# Altium schematic sheet FPGA_POWER.SchDoc
size A4
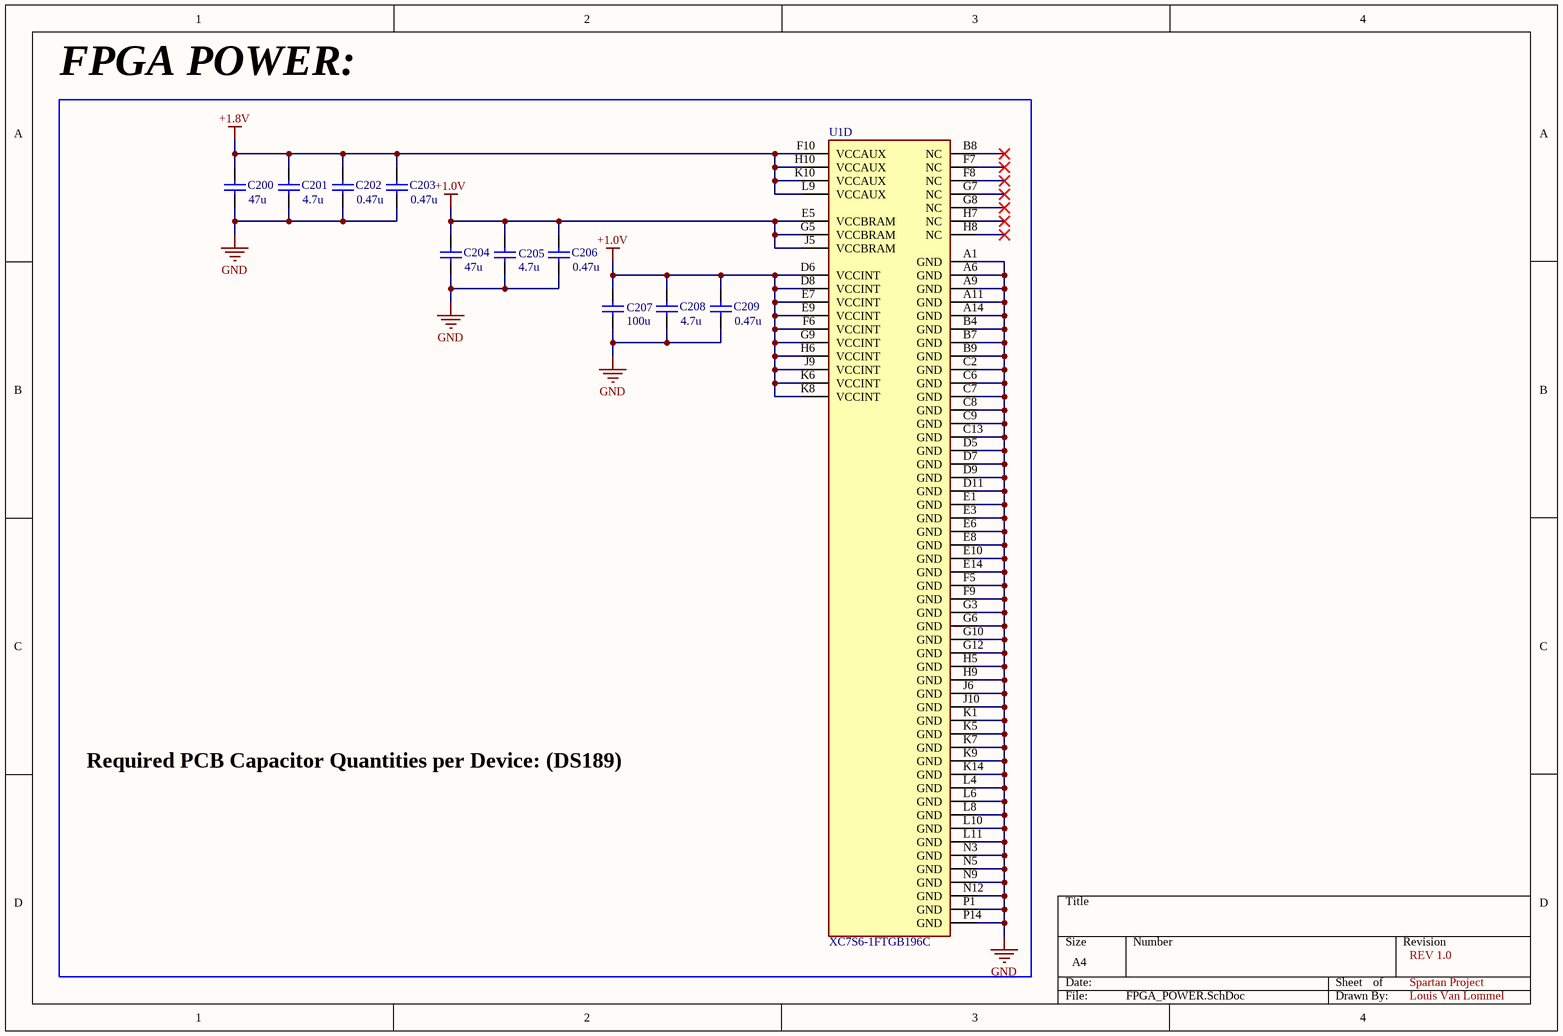
[diagram p0: FPGA_POWER.SchDoc]

## Parts
C200  value 47u  [CAP_0603]  (hidden comment: 47uF)
C201  4.7u  [CAP_0402]
C202  value 0.47u  [CAP_0402]  (hidden comment: 0.47uF)
C203  value 0.47u  [CAP_0402]  (hidden comment: 0.47uF)
C204  value 47u  [CAP_0603]  (hidden comment: 47uF)
C205  4.7u  [CAP_0402]
C206  value 0.47u  [CAP_0402]  (hidden comment: 0.47uF)
C207  value 100u  [CAP_0805]  (hidden comment: 100uF)
C208  4.7u  [CAP_0402]
C209  value 0.47u  [CAP_0402]  (hidden comment: 0.47uF)
U1  XC7S6-1FTGB196C  [FP-XC7S6-1FTGB196C-MFG]  (part D of 4)

## Nets
+1.0V: C204.2 C205.2 C206.2 C207.2 C208.2 C209.2 U1.D6(VCCINT) U1.D8(VCCINT) U1.E5(VCCBRAM) U1.E7(VCCINT) U1.E9(VCCINT) U1.F6(VCCINT) U1.G5(VCCBRAM) U1.G9(VCCINT) U1.H6(VCCINT) U1.J5(VCCBRAM) U1.J9(VCCINT) U1.K6(VCCINT) U1.K8(VCCINT)
+1.8V: C200.2 C201.2 C202.2 C203.2 U1.F10(VCCAUX) U1.H10(VCCAUX) U1.K10(VCCAUX) U1.L9(VCCAUX)
GND: C200.1 C201.1 C202.1 C203.1 C204.1 C205.1 C206.1 C207.1 C208.1 C209.1 U1.A1(GND) U1.A6(GND) U1.A9(GND) U1.A11(GND) U1.A14(GND) U1.B4(GND) U1.B7(GND) U1.B9(GND) U1.C2(GND) U1.C6(GND) U1.C7(GND) U1.C8(GND) U1.C9(GND) U1.C13(GND) U1.D5(GND) U1.D7(GND) U1.D9(GND) U1.D11(GND) U1.E1(GND) U1.E3(GND) U1.E6(GND) U1.E8(GND) U1.E10(GND) U1.E14(GND) U1.F5(GND) U1.F9(GND) U1.G3(GND) U1.G6(GND) U1.G10(GND) U1.G12(GND) U1.H5(GND) U1.H9(GND) U1.J6(GND) U1.J10(GND) U1.K1(GND) U1.K5(GND) U1.K7(GND) U1.K9(GND) U1.K14(GND) U1.L4(GND) U1.L6(GND) U1.L8(GND) U1.L10(GND) U1.L11(GND) U1.N3(GND) U1.N5(GND) U1.N9(GND) U1.N12(GND) U1.P1(GND) U1.P14(GND)

Not connected (* = marked no-connect by the designer): U1 B8(NC)* F7(NC)* F8(NC)* G7(NC)* G8(NC)* H7(NC)* H8(NC)*

## Notes on the sheet
- FPGA POWER:
- Required PCB Capacitor Quantities per Device: (DS189)
- REV 1.0
- Spartan Project
- Louis Van Lommel

## Library data of the parts
C200-C209 = Cap: Capacitor; Published: 8-Jun-2000; LatestRevisionDate: 17-Jul-2002; LatestRevisionNote: Re-released for DXP Platform.; PackageReference: RAD-0.3; Publisher: Altium Limited; PackageDescription: Radial Cap, Thru-Hole; 2 Leads; 0.3 in Pin Spacing
  C201 C205 C208: Value: 4.7u
U1 = CMP-17530-000008-1: Manufacturer: Xilinx; Standoff Height: 0.3mm; Max Supply Voltage: 3.465V; Number Of Logic Elements Cells: 6000; Number Of I/Os: 100; Min Supply Voltage: 0.95V; Ram Size: 180Kbits; Frequency: 200MHz; Max Junction Temp: +85°C; Speed Grade: 1; Propagation Delay: 0.13ns; Number Of Logic Blocks: 938; Lead Free: Yes; Device Class L1: Integrated Circuits (ICs); Category: IC; Ipc Land Pattern Name: BGA196C100P14X14_1500X1500X146; Manufacturer Part Number: XC7S6-1FTGB196C; Temperature Range High: +85°C; ComponentLink2Description: Datasheet; Package: XC7S6-1FTGB196C; Height: 1.55mm; Device Class L2: Embedded Processors and Controllers; Digikey Description: XC7S6-1FTGB196C; Temperature: 0°C to +85°C; Device Class L3: FPGAs - Field Programmable Gate Arrays; Automotive: No; Octopart: https://octopart.com/xc7s6-1ftgb196c-xilinx-81890684; Footprint Url: https://www.xilinx.com/support/documentation/user_guides/ug475_7Series_Pkg_Pinout.pdf; ComponentLink2URL: https://www.xilinx.com/support/documentation/data_sheets/ds189-spartan-7-data-sheet.pdf; RoHS: TRUE; Temperature Range Low: 0°C